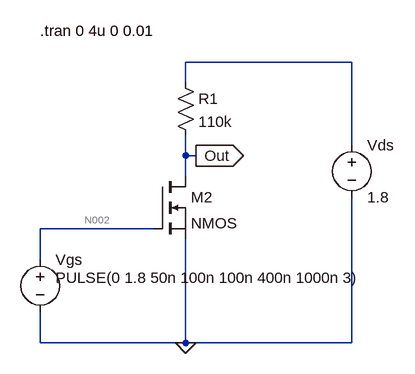
[diagram p0: schematic level 1.asc]
level 1.asc, the LTspice schematic file:
Version 4
SHEET 1 880 680
WIRE 448 48 192 48
WIRE 192 80 192 48
WIRE 448 176 448 48
WIRE 192 192 192 160
WIRE 208 192 192 192
WIRE 192 224 192 192
WIRE 144 304 -32 304
WIRE -32 352 -32 304
WIRE -32 480 -32 432
WIRE 192 480 192 320
WIRE 192 480 -32 480
WIRE 448 480 448 256
WIRE 448 480 192 480
FLAG 192 480 0
FLAG 208 192 Out
IOPIN 208 192 Out
SYMBOL nmos 144 224 R0
SYMATTR InstName M2
SYMBOL voltage -32 336 R0
WINDOW 123 0 0 Left 0
WINDOW 39 0 0 Left 0
WINDOW 3 24 44 Left 2
SYMATTR InstName Vgs
SYMATTR Value PULSE(0 1.8 50n 100n 100n 400n 1000n 3)
SYMBOL voltage 448 160 R0
SYMATTR InstName Vds
SYMATTR Value 1.8
SYMBOL res 176 64 R0
SYMATTR InstName R1
SYMATTR Value 110k
TEXT -32 0 Left 2 !.tran 0 4u 0 0.01

The netlist it stands for:
* level 1.asc
M2 Out N002 0 0 NMOS
Vgs N002 0 PULSE(0 1.8 50n 100n 100n 400n 1000n 3)
Vds N001 0 1.8
R1 N001 Out 110k
.model NMOS NMOS
.model PMOS PMOS
.lib standard.mos
.tran 0 4u 0 0.01
.backanno
.end

* Results of the author's LTspice run, read from the files saved beside the schematic
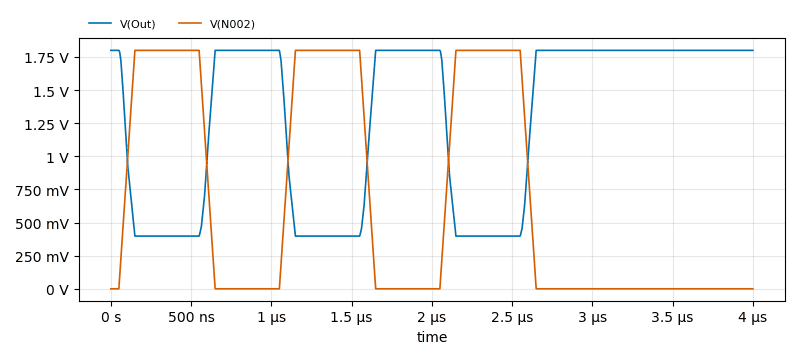
[diagram p1: Transient Analysis of level 1.asc, plotted from the saved traces]
* Transient Analysis, 1 run:
*   V(Out): min 398 mV, max 1.8 V, average 1.267 V, rms 1.425 V, last 1.8 V
*   V(N002): min 0 V, max 1.8 V, average 675 mV, rms 1.069 V, last 0 V